# Altium schematic sheet VehicleTracking.SchDoc
size A4; SheetNumber: 1; SheetTotal: 1
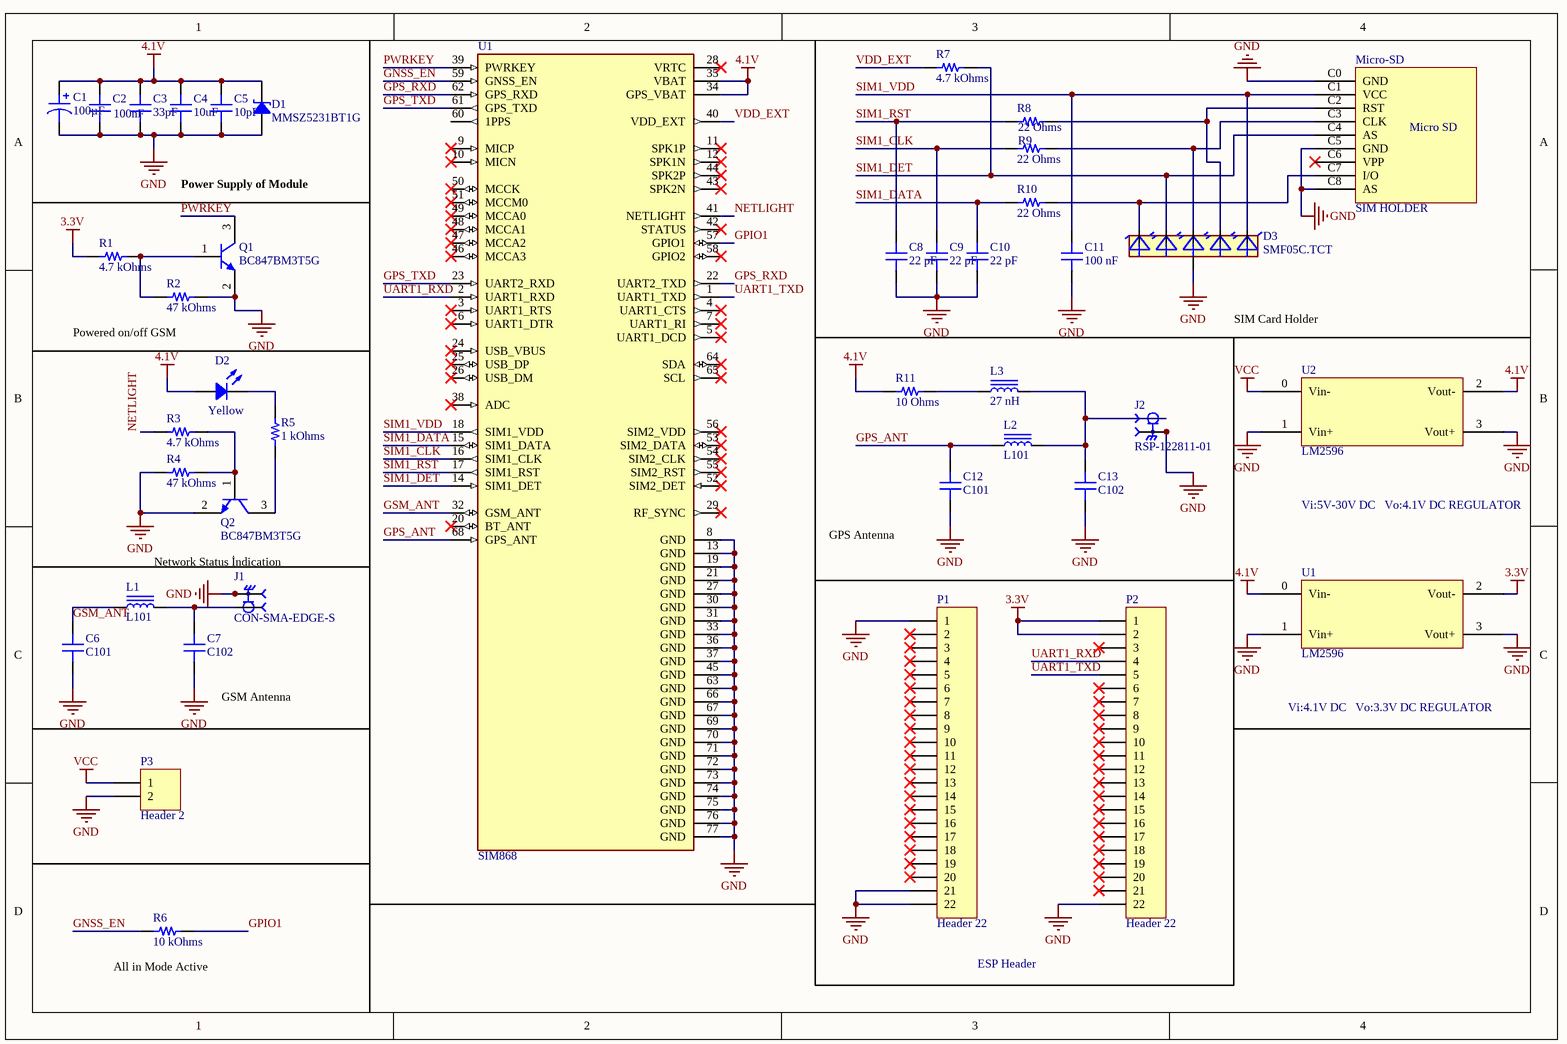
[diagram p0: VehicleTracking.SchDoc]

## Parts
(Parts that share a designator on the sheet are numbered #1, #2 ... from top to bottom, then left to right.)
C1  100µF  [CAP POL 1411_3528]
C2  100nF  [CAP 0603_1608]
C3  33pF  [CAP 0603_1608]
C4  10uF  [CAP 0603_1608]
C5  10pF  [CAP 0603_1608]
C6  C101  [CAP 0603_1608]
C7  C102  [CAP 0603_1608]
C8  22 pF  [CAP 0603_1608]
C9  22 pF  [CAP 0603_1608]
C10  22 pF  [CAP 0603_1608]
C11  100 nF  [CAP 0603_1608]
C12  C101  [CAP 0603_1608]
C13  C102  [CAP 0603_1608]
D1  MMSZ5231BT1G  [SOD-123]
D2  Yellow  [LED 1206_3216 YELLOW]
D3  SMF05C.TCT  [SC70-6]
J1  CON-SMA-EDGE-S  [RFSOLUTIONS_CON-SMA-EDGE-S]
J2  RSP-122811-01  [SAMTEC_RSP-122811-01]
L1  L101  [IND 0402_1005]
L2  L101  [IND 0402_1005]
L3  27 nH  [IND 0402_1005]
Micro-SD  SIM HOLDER  [115R-BCA0]
P1  Header 22  [HDR1X22]
P2  Header 22  [HDR1X22]
P3  Header 2  [HDR1X2]
Q1  BC847BM3T5G  [ON SEMI SOT-723]
Q2  BC847BM3T5G  [ON SEMI SOT-723]
R1  4.7 kOhms  [RES 0603_1608]
R2  47 kOhms  [RES 0603_1608]
R3  4.7 kOhms  [RES 0603_1608]
R4  47 kOhms  [RES 0603_1608]
R5  1 kOhms  [RES 0603_1608]
R6  10 kOhms  [RES 0603_1608]
R7  4.7 kOhms  [RES 0603_1608]
R8  22 Ohms  [RES 0603_1608]
R9  22 Ohms  [RES 0603_1608]
R10  22 Ohms  [RES 0603_1608]
R11  10 Ohms  [RES 0603_1608]
U1#1  SIM868  [XCVR_SIM868]
U1#2  LM2596  [LM2596]
U2  LM2596  [LM2596]

## Nets
3.3V: P2.1 P2.2 R1.1 U1#2.2(Vout-)
4.1V: C1.1 C2.2 C3.2 C4.2 C5.2 D1.2 D2.1 R11.1 U1#1.34(GPS_VBAT) U1#1.35(VBAT) U1#2.0(Vin-) U2.2(Vout-)
GND: C1.2 C2.1 C3.1 C4.1 C5.1 C6.1 C7.1 C8.1 C9.1 C10.1 C11.1 C12.1 C13.1 D1.1 D3.2(A) J1.G1 J1.G2 J1.G3 J1.G4 J2.G1(GND) J2.G2(GND) Micro-SD.C0(GND) Micro-SD.C5(GND) Micro-SD.C8(AS) P1.1 P1.21 P1.22 P2.22 P3.2 Q1.2(E) Q2.2(E) R2.2 R4.1 U1#1.8(GND) U1#1.13(GND) U1#1.19(GND) U1#1.21(GND) U1#1.27(GND) U1#1.30(GND) U1#1.31(GND) U1#1.33(GND) U1#1.36(GND) U1#1.37(GND) U1#1.45(GND) U1#1.63(GND) U1#1.66(GND) U1#1.67(GND) U1#1.69(GND) U1#1.70(GND) U1#1.71(GND) U1#1.72(GND) U1#1.73(GND) U1#1.74(GND) U1#1.75(GND) U1#1.76(GND) U1#1.77(GND) U1#2.1(Vin+) U1#2.3(Vout+) U2.1(Vin+) U2.3(Vout+)
VCC: P3.1 U2.0(Vin-)
GNSS_EN: R6.1 U1#1.59(GNSS_EN)
GPIO1: R6.2 U1#1.57(GPIO1)
GPS_ANT: C12.2 L2.1 U1#1.68(GPS_ANT)
GPS_RXD: U1#1.22(UART2_TXD) U1#1.62(GPS_RXD)
GPS_TXD: U1#1.23(UART2_RXD) U1#1.61(GPS_TXD)
GSM_ANT: C6.2 L1.1 U1#1.32(GSM_ANT)
NETLIGHT: R3.1 U1#1.41(NETLIGHT)
PWRKEY: Q1.3(C) U1#1.39(PWRKEY)
SIM1_CLK: C9.2 R9.1 U1#1.16(SIM1_CLK)
SIM1_DATA: C10.2 R10.1 U1#1.15(SIM1_DATA)
SIM1_DET: D3.3(C2) Micro-SD.C4(AS) R7.2 U1#1.14(SIM1_DET)
SIM1_RST: C8.2 R8.1 U1#1.17(SIM1_RST)
SIM1_VDD: C11.2 D3.6(C5) Micro-SD.C1(VCC) U1#1.18(SIM1_VDD)
UART1_RXD: P2.4 U1#1.2(UART1_RXD)
UART1_TXD: P2.5 U1#1.1(UART1_TXD)
VDD_EXT: R7.1 U1#1.40(VDD_EXT)
NetC7_2: C7.2 J1.1 L1.2
NetC13_2: C13.2 J2.1 L2.2 L3.2
NetD2_2: D2.2 R5.2
NetD3_1: D3.1(C1) Micro-SD.C7(I/O) R10.2
NetD3_4: D3.4(C3) Micro-SD.C3(CLK) R9.2
NetD3_5: D3.5(C4) Micro-SD.C2(RST) R8.2
NetL3_1: L3.1 R11.2
NetQ1_1: Q1.1(B) R1.2 R2.1
NetQ2_1: Q2.1(B) R3.2 R4.2
NetQ2_3: Q2.3(C) R5.1

Not connected (* = marked no-connect by the designer): Micro-SD C6(VPP)*; P1 2* 3* 4* 5* 6* 7* 8* 9* 10* 11* 12* 13* 14* 15* 16* 17* 18* 19* 20*; P2 3* 6* 7* 8* 9* 10* 11* 12* 13* 14* 15* 16* 17* 18* 19* 20* 21*; U1#1 3(UART1_RTS)* 4(UART1_CTS)* 5(UART1_DCD)* 6(UART1_DTR)* 7(UART1_RI)* 9(MICP)* 10(MICN)* 11(SPK1P)* 12(SPK1N)* 20(BT_ANT)* 24(USB_VBUS)* 25(USB_DP)* 26(USB_DM)* 28(VRTC)* 29(RF_SYNC)* 38(ADC)* 42(STATUS)* 43(SPK2N)* 44(SPK2P)* 46(MCCA3)* 47(MCCA2)* 48(MCCA1)* 49(MCCA0)* 50(MCCK)* 51(MCCM0)* 52(SIM2_DET)* 53(SIM2_DATA)* 54(SIM2_CLK)* 55(SIM2_RST)* 56(SIM2_VDD)* 58(GPIO2)* 60(1PPS) 64(SDA)* 65(SCL)*

## Notes on the sheet
- Power Supply of Module
- SIM Card Holder
- (near R2) Powered on/off GSM
- Vi:5V-30V DC   Vo:4.1V DC REGULATOR
- Network Status İndication
- (near C12) GPS Antenna
- (near C7) GSM Antenna
- Vi:4.1V DC   Vo:3.3V DC REGULATOR
- (near R6) All in Mode Active
- ESP Header
- (in symbol 115R-BCA0) Micro SD

## Library data of the parts
C1 = F930J107MBA: CAP TANT 100UF 20% 6.3V 1411; manufacturer: AVX Corporation; Manufacturer Size Code: B; ESR (Equivalent Series Resistance): 900mOhm @ 100kHz; Lifetime @ Temp.: 2000 Hrs @ 125°C; Type: Molded; Part Number: F930J107MBA; Value: 100µF; Capacitance: 100µF; componentlink1description: Datasheet; componentlink1url: http://datasheets.avx.com/F93.pdf; componentlink2description: DigiKey Link; componentlink2url: http://digikey.com/product-detail/en/avx-corporation/F930J107MBA/478-8156-1-ND/4005661; Device Package: 1411 (3528 Metric); Features: General Purpose; Height - Seated (Max): 0.091" (2.30mm); lastupdated: 2.09.2020 01:15:45; Lifecycle Status: Active; Minimum Order: 1; Mounting Type: Surface Mount; Operating Temperature: -55°C ~ 125°C; Package / Case: 1411 (3528 Metric); packaging: TapeAndReel; partid: 257; Part Status: Active; price: 0.14; series: F93; Size / Dimension: 0.138" L x 0.110" W (3.50mm x 2.80mm); Supplier 1: DigiKey; Supplier Part Number 1: 478-8156-1-ND; Tolerance: ±20%; Voltage - Rated: 6.3V
C2-C5 = 600S2R7AW250XT: CAP CER 2.7PF 250V NP0 0603; manufacturer: American Technical Ceramics; Temperature Coefficient: C0G, NP0; Tolerance: ±0.05pF; Part Number: 600S2R7AW250XT; Applications: RF, Microwave, High Frequency, Bypass, Decoupling; Capacitance: 2.7 pF; componentlink1description: Datasheet; componentlink1url: http://www.atceramics.com/UserFiles/600s.pdf; componentlink2description: DigiKey Link; componentlink2url: https://www.digikey.com/en/products/detail/american-technical-ceramics/600S2R7AW250XT/3909029; Device Package: 0603 (1608 Metric); Features: High Q, Low Loss, Ultra Low ESR; lastupdated: 5.11.2023 20:09:27; Lifecycle Status: Active; Minimum Order: 1; Mounting Type: Surface Mount, MLCC; Operating Temperature: -55°C ~ 125°C; Package / Case: 0603 (1608 Metric); packaging: TapeAndReel; partid: 2143; Part Status: Active; price: 0.41; series: ATC 600S; Size / Dimension: 0.063" L x 0.032" W (1.60mm x 0.81mm); Supplier 1: DigiKey; Supplier Part Number 1: 478-12310-1-ND; Thickness (Max): 0.035" (0.89mm); Voltage - Rated: 250V
  C2: Value: 100nF
  C3: Value: 33pF
  C4: Value: 10uF
  C5: Value: 10pF
C6-C13 = C0603C272F3GAC7867: CAP CER 2700PF 25V NP0 0603; manufacturer: KEMET; Temperature Coefficient: C0G, NP0; Tolerance: ±1%; Part Number: C0603C272F3GAC7867; Applications: General Purpose; Capacitance: 2700 pF; componentlink1description: Datasheet; componentlink1url: https://api.kemet.com/component-edge/download/datasheet/C0603C272F3GACTU.pdf; componentlink2description: DigiKey Link; componentlink2url: https://www.digikey.com/en/products/detail/kemet/C0603C272F3GAC7867/2200413; Device Package: 0603 (1608 Metric); Features: Low ESL; lastupdated: 5.11.2023 20:09:28; Lifecycle Status: Active; Minimum Order: 1; Mounting Type: Surface Mount, MLCC; Operating Temperature: -55°C ~ 125°C; Package / Case: 0603 (1608 Metric); packaging: TapeAndReel; partid: 2138; Part Status: Active; price: 0.40; series: SMD Comm C0G; Size / Dimension: 0.063" L x 0.031" W (1.60mm x 0.80mm); Supplier 1: DigiKey; Supplier Part Number 1: 399-17403-1-ND; Thickness (Max): 0.034" (0.87mm); Voltage - Rated: 25V
  C6 C12: Value: C101
  C7 C13: Value: C102
  C8-C10: Value: 22 pF
  C11: Value: 100 nF
D1 = MMSZ5231BT1G: DIODE ZENER 5.1V 500MW SOD123; Manufacturer: ON Semiconductor; Current - Reverse Leakage @ Vr: 5µA @ 2V; Impedance (Max) (Zzt): 17 Ohms; Tolerance: ±5%; Voltage - Forward (Vf) (Max) @ If: 900mV @ 10mA; Part Number: MMSZ5231BT1G; ComponentLink1Description: Datasheet; ComponentLink1URL: http://www.onsemi.com/pub/Collateral/MMSZ5221BT1-D.PDF; ComponentLink2Description: DigiKey Link; ComponentLink2URL: http://digikey.com/product-detail/en/on-semiconductor/MMSZ5231BT1G/MMSZ5231BT1GOSCT-ND/964561; LastUpdated: 5.11.2023 21:26:31; Lifecycle Status: Active; Minimum Order: 1; Mounting Type: Surface Mount; Operating Temperature: -55°C ~ 150°C; Package / Case: SOD-123; Packaging: TapeAndReel; PartId: 2389; Part Status: Active; Power - Max: 500mW; Price: 0.03; Series: Automotive, AEC-Q101; Supplier 1: DigiKey; Supplier Part Number 1: MMSZ5231BT1GOSCT-ND; Supplier Device Package: SOD-123; Voltage - Zener (Nom) (Vz): 5.1V
D2 = 5990240007F: LED YELLOW 1206 SMD; Manufacturer: Dialight; Configuration: Standard; Current - Test: 20mA; Lens Color: 0.80mm; Lens Size: 2.00mm x 1.60mm; Lens Style: Rectangle with Flat Top; Millicandela Rating: 126mcd; Viewing Angle: 140°; Voltage - Forward (Vf) (Typ): 2.1V; Wavelength - Dominant: 590nm; Part Number: 5990240007F; Color: Yellow; ComponentLink1Description: Datasheet; ComponentLink1URL: http://www.dialightsignalsandcomponents.com/Assets/Brochures_And_Catalogs/Indication/CBI_SMD_new/Dialight_CBI_data_599-1206_Apr2018.pdf; ComponentLink2Description: DigiKey Link; ComponentLink2URL: https://www.digikey.com/en/products/detail/dialight/5990240007F/9385418; Device Package: 1206 (3216 Metric); Height (Max): 0.80mm; LastUpdated: 5.11.2023 21:32:29; Lifecycle Status: Active; Minimum Order: 1; Mounting Type: Surface Mount; Package / Case: 1206 (3216 Metric); Packaging: TapeAndReel; PartId: 1; Part Status: Active; Price: 0.04; Series: 599; Size / Dimension: 3.20mm L x 1.60mm W; Supplier 1: DigiKey; Supplier Part Number 1: 350-4363-1-ND; Supplier Device Package: 1206; Value: Yellow
D3 = SMF05C.TCT: 12.5V Clamp 8A (8/20Âµs) Ipp Tvs Diode Surface Mount SC-70-6; MF: Semtech; Check_prices: https://www.snapeda.com/parts/SMF05C.TCT/Semtech+Corporation/view-part/?ref=eda; Value: *; Availability: In Stock; MP: SMF05C.TCT; Price: None; Package: SC-70-6 Semtech; SnapEDA_Link: https://www.snapeda.com/parts/SMF05C.TCT/Semtech+Corporation/view-part/?ref=snap; Purchase-URL: https://pricing.snapeda.com/search/part/SMF05C.TCT/?ref=eda
J1 = CON-SMA-EDGE-S: SMA Connector Jack, Female Socket - Board Edge, End Launch Solder; MF: RF Solutions; Value: *; SnapEDA_Link: https://www.snapeda.com/parts/CON-SMA-EDGE-S/RF+Solutions/view-part/?ref=snap; Purchase-URL: https://pricing.snapeda.com/search/part/CON-SMA-EDGE-S/?ref=eda; Check_prices: https://www.snapeda.com/parts/CON-SMA-EDGE-S/RF+Solutions/view-part/?ref=eda; Digi-Key_Part_Number: CON-SMA-EDGE-S-ND; Package: None; MP: CON-SMA-EDGE-S
J2 = RSP-122811-01: U.FL (UMCC), IPEX MHF1 Connector Receptacle, Male Pin 50Ohm Surface Mount Solder; Availability: Unavailable; MP: RSP-122811-01; Value: *; Price: None; Package: None
L1-L3 = WCI1005CP5N6GDG: CHIP IND 1005,5.6NH,G,20Q,0.76A,; Manufacturer: INPAQ Technology Co., Ltd; Current Rating (Amps): 760 mA; DC Resistance (DCR): 83mOhm Max; Frequency - Self Resonant: 4.8GHz; Inductance Frequency - Test: 250 MHz; Material - Core: Ceramic; Q @ Freq: 48 @ 900MHz; Shielding: Unshielded; Tolerance: ±2%; Type: Wirewound; Part Number: WCI1005CP5N6GDG; ComponentLink1Description: Datasheet; ComponentLink1URL: https://mm.digikey.com/Volume0/opasdata/d220001/medias/docus/5561/WCI1005CP Series.pdf; ComponentLink2Description: DigiKey Link; ComponentLink2URL: https://www.digikey.com/en/products/detail/inpaq-technology-co-ltd/WCI1005CP5N6GDG/20486592; Device Package: 0402 (1005 Metric); Height - Seated (Max): 0.026" (0.66mm); Inductance: 5.6 nH; LastUpdated: 5.11.2023 21:41:35; Lifecycle Status: Active; Minimum Order: 1; Mounting Type: Surface Mount; Operating Temperature: -25°C ~ 125°C; Package / Case: 0402 (1005 Metric); Packaging: TapeAndReel; PartId: 6805; Price: 0.05; Series: WCI1005CP; Size / Dimension: 0.047" L x 0.025" W (1.19mm x 0.64mm); Supplier 1: DigiKey; Supplier Part Number 1: 3526-WCI1005CP5N6GDGCT-ND; Supplier Device Package: 0402; Value: 5.6 nH
Micro-SD = 115R-BCA0
P1 P2 = Header 22: Header, 22-Pin; LatestRevisionDate: 17-Jul-2002; LatestRevisionNote: Re-released for DXP Platform.; Publisher: Altium Limited
P3 = Header 2: Header, 2-Pin; LatestRevisionDate: 17-Jul-2002; LatestRevisionNote: Re-released for DXP Platform.; Publisher: Altium Limited
Q1 Q2 = BC847BM3T5G: TRANS NPN 45V 0.1A SOT-723; Manufacturer: ON Semiconductor; Current - Collector Cutoff (Max): 15nA (ICBO); Current - Collector (Ic) (Max): 100mA; DC Current Gain (hFE) (Min) @ Ic, Vce: 200 @ 2mA, 5V; Frequency - Transition: 100MHz; Power - Max: 260mW; Vce Saturation (Max) @ Ib, Ic: 600mV @ 5mA, 100mA; Part Number: BC847BM3T5G; ComponentLink1Description: Datasheet; ComponentLink1URL: http://www.onsemi.com/pub/Collateral/BC847BM3-D.PDF; ComponentLink2Description: DigiKey Link; ComponentLink2URL: http://digikey.com/product-detail/en/on-semiconductor/BC847BM3T5G/BC847BM3T5GOSCT-ND/3487296; LastUpdated: 5.11.2023 21:52:22; Lifecycle Status: Active; Minimum Order: 1; Mounting Type: Surface Mount; Operating Temperature: -55°C ~ 150°C (TJ); Package / Case: SOT-723; Packaging: TapeAndReel; PartId: 18; Part Status: Active; Price: 0.04; Series: -; Supplier 1: DigiKey; Supplier Part Number 1: BC847BM3T5GOSCT-ND; Supplier Device Package: SOT-723; Transistor Type: NPN; Voltage - Collector Emitter Breakdown (Max): 45V
R1-R5 R7-R11 = RNCS0603BKE10K0: RES 10K OHM 0.1% 1/16W 0603; Manufacturer: Stackpole Electronics Inc; Power (Watts): 0.063W, 1/16W; Resistance: 10 kOhms; Temperature Coefficient: ±25ppm/°C; Part Number: RNCS0603BKE10K0; ComponentLink1Description: Datasheet; ComponentLink1URL: https://www.seielect.com/catalog/sei-rncs_rnch.pdf; ComponentLink2Description: DigiKey Link; ComponentLink2URL: https://www.digikey.com/en/products/detail/stackpole-electronics-inc/RNCS0603BKE10K0/1708836; Composition: Thin Film; Device Package: 0603 (1608 Metric); Features: Anti-Corrosive, Automotive AEC-Q200, Moisture Resistant; Height - Seated (Max): 0.022" (0.55mm); LastUpdated: 5.11.2023 20:39:24; Lifecycle Status: Active; Minimum Order: 1; Number of Terminations: 2; Operating Temperature: -55°C ~ 155°C; Package / Case: 0603 (1608 Metric); Packaging: TapeAndReel; PartId: 4838; Part Status: Active; Price: 0.06; Ratings: AEC-Q200; Series: RNCS; Size / Dimension: 0.061" L x 0.031" W (1.55mm x 0.80mm); Supplier 1: DigiKey; Supplier Part Number 1: RNCS0603BKE10K0CT-ND; Supplier Device Package: 0603; Tolerance: ±0.1%
  R1 R3 R7: Value: 4.7 kOhms
  R2 R4: Value: 47 kOhms
  R5: Value: 1 kOhms
  R8-R10: Value: 22 Ohms
  R11: Value: 10 Ohms
R6 = RNCS0603BKE100R: RES 100 OHM 0.1% 1/16W 0603; Manufacturer: Stackpole Electronics Inc; Power (Watts): 0.063W, 1/16W; Resistance: 100 Ohms; Temperature Coefficient: ±25ppm/°C; Part Number: RNCS0603BKE100R; Value: 10 kOhms; ComponentLink1Description: Datasheet; ComponentLink1URL: https://www.seielect.com/catalog/sei-rncs_rnch.pdf; ComponentLink2Description: DigiKey Link; ComponentLink2URL: https://www.digikey.com/en/products/detail/stackpole-electronics-inc/RNCS0603BKE100R/1799988; Composition: Thin Film; Device Package: 0603 (1608 Metric); Features: Anti-Corrosive, Automotive AEC-Q200, Moisture Resistant; Height - Seated (Max): 0.022" (0.55mm); LastUpdated: 5.11.2023 20:39:24; Lifecycle Status: Active; Minimum Order: 1; Number of Terminations: 2; Operating Temperature: -55°C ~ 155°C; Package / Case: 0603 (1608 Metric); Packaging: TapeAndReel; PartId: 4839; Part Status: Active; Price: 0.06; Ratings: AEC-Q200; Series: RNCS; Size / Dimension: 0.061" L x 0.031" W (1.55mm x 0.80mm); Supplier 1: DigiKey; Supplier Part Number 1: RNCS0603BKE100RCT-ND; Supplier Device Package: 0603; Tolerance: ±0.1%
U1#1 = SIM868: SIM868 GNSS, GSM RF mikroBUSâ„¢ Clickâ„¢ Platform Evaluation Expansion Board; MF: MikroElektronika; Check_prices: https://www.snapeda.com/parts/SIM868/MikroElektronika/view-part/?ref=eda; Value: *; Availability: Not in stock; MP: SIM868; Price: None; Package: None; SnapEDA_Link: https://www.snapeda.com/parts/SIM868/MikroElektronika/view-part/?ref=snap